# Altium project MCU_project.PrjPcb
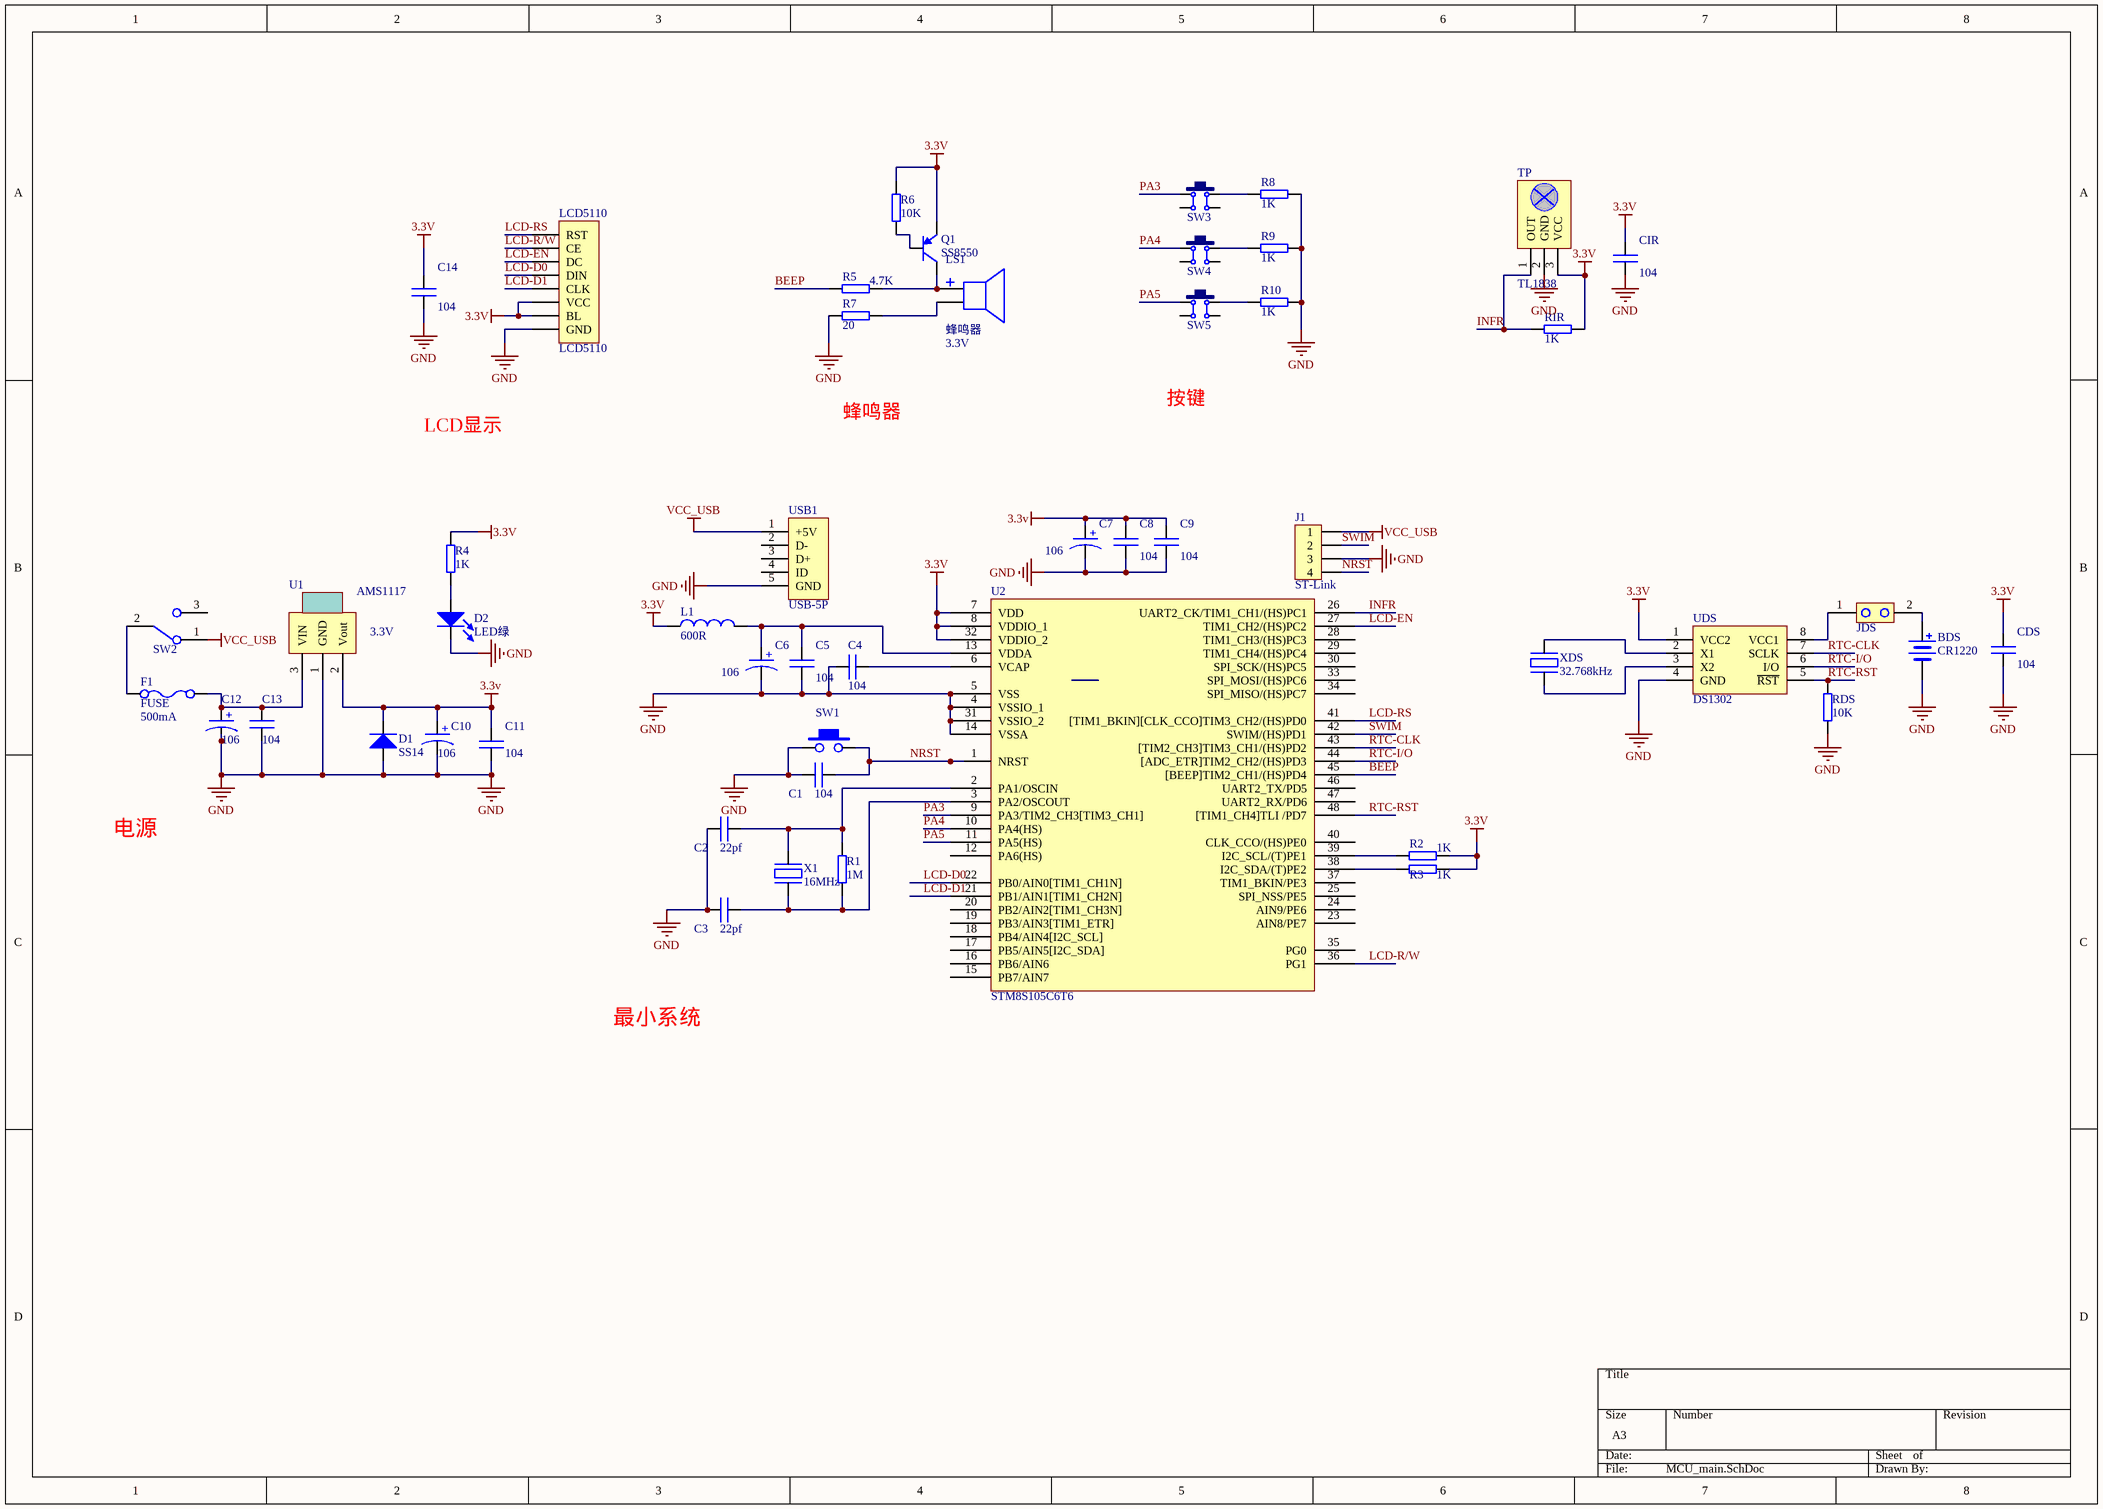
[diagram p0: MCU_main.SchDoc]
1 sheet, 50 parts. Net scope: global (net labels, ports and power ports of the same name join across sheets).
Board file: MCU_project.PcbDoc

## Sheet MCU_main.SchDoc
size A3; PageSetup: Record=PageOptions|CenterHorizontal=True|CenterVertical=True|PrintScale=1.00|XCorrection=1.00|YCorrection=1.00|PrintKind=1|BorderSize=5000000|LeftOffset=0|BottomOffset=0|Orientation=2|PaperLength=1000|PaperWidth=1000|Scale=100|PaperSource=7|PrintQuality=-3|MediaType=1|DitherType=10|PrintScaleMode=1|PaperKind=A3|PaperIndex=8

### Parts
BDS  CR1220  [CR1220-贴片]
C1  value 104  [0603]  (hidden comment: CAP - 无极性)
C2  value 22pf  [0603]  (hidden comment: CAP - 无极性)
C3  value 22pf  [0603]  (hidden comment: CAP - 无极性)
C4  value 104  [0603]  (hidden comment: CAP - 无极性)
C5  value 104  [0603]  (hidden comment: CAP - 无极性)
C6  value 106  [1206(-+)]  (hidden comment: CAP - 有极性)
C7  value 106  [1206(-+)]  (hidden comment: CAP - 有极性)
C8  value 104  [0603]  (hidden comment: CAP - 无极性)
C9  value 104  [0603]  (hidden comment: CAP - 无极性)
C10  value 106  [1206(-+)]  (hidden comment: CAP - 有极性)
C11  value 104  [0603]  (hidden comment: CAP - 无极性)
C12  value 106  [1206(-+)]  (hidden comment: CAP - 有极性)
C13  value 104  [0603]  (hidden comment: CAP - 无极性)
C14  value 104  [0603]  (hidden comment: CAP - 无极性)
CDS  value 104  [0603]  (hidden comment: CAP - 无极性)
CIR  value 104  [0603]  (hidden comment: CAP - 无极性)
D1  SS14  [SMA]
D2  LED绿  [0603(+-)]
F1  FUSE  value 500mA  [1812]
J1  ST-Link  [HEADER_1*4P_XH2.54_卧式]
JDS  HEADER_1*2P  [HEADER_1*2P]  (value not drawn)
L1  value 600R  [0603]  (hidden comment: L磁珠/电感)
LCD5110  LCD5110  [LCD5110]
LS1  蜂鸣器  value 3.3V  [蜂鸣器]
Q1  SS8550  [SOT23-3N]
R1  value 1M  [0603]  (hidden comment: Res - SMD)
R2  value 1K  [0603]  (hidden comment: Res - SMD)
R3  value 1K  [0603]  (hidden comment: Res - SMD)
R4  value 1K  [0603]  (hidden comment: Res - SMD)
R5  value 4.7K  [0603]  (hidden comment: Res - SMD)
R6  value 10K  [0603]  (hidden comment: Res - SMD)
R7  value 20  [0603]  (hidden comment: Res - SMD)
R8  value 1K  [0603]  (hidden comment: Res - SMD)
R9  value 1K  [0603]  (hidden comment: Res - SMD)
R10  value 1K  [0603]  (hidden comment: Res - SMD)
RDS  value 10K  [0603]  (hidden comment: Res - SMD)
RIR  value 1K  [0603]  (hidden comment: Res - SMD)
SW1  Switch - 轻触  [Switch - 轻触SMD_4Pins]  (value not drawn)
SW2  Switch - 拨动-三脚两档  [Switch - 拨动-三脚两档]  (value not drawn)
SW3  6x6x5  [TSW DIP-6*6*6]  (value not drawn)
SW4  6x6x5  [TSW DIP-6*6*6]  (value not drawn)
SW5  6x6x5  [TSW DIP-6*6*6]  (value not drawn)
TP  TL1838  [红外遥控接收头]
U1  AMS1117  value 3.3V  [SOT223_L]
U2  STM8S105C6T6  [LQFP48]
UDS  DS1302  [DIP-8]
USB1  USB-5P  [USB-MICRO_A]
X1  value 16MHz  [XTAL(4.88mm)]  (hidden comment: 石英晶振)
XDS  value 32.768kHz  [XTAL(圆柱型2*6mm)]  (hidden comment: 石英晶振)

### Nets
3.3V: C7.1(+) C8.1 C9.1 C10.1(+) C11.1 C14.1 CDS.1 CIR.1 D1.2 L1.1 LCD5110.6(VCC) LCD5110.7(BL) Q1.2(E) R2.2 R3.2 R4.1 R6.2 RIR.1 TP.3(VCC) U1.2(Vout) U2.7(VDD) U2.8(VDDIO_1) U2.32(VDDIO_2) UDS.1(VCC2)
GND: BDS.2(-) C1.1 C2.1 C3.1 C4.1 C5.2 C6.2 C7.2 C8.2 C9.2 C10.2 C11.2 C12.2 C13.1 C14.2 CDS.2 CIR.2 D1.1 D2.2(K) J1.3 LCD5110.8(GND) R7.1 R8.1 R9.2 R10.2 RDS.2 SW1.1 TP.2(GND) U1.1(GND) U2.4(VSSIO_1) U2.5(VSS) U2.14(VSSA) U2.31(VSSIO_2) UDS.4(GND) USB1.5(GND)
VCC_USB: J1.1 SW2.1 USB1.1(+5V)
BEEP: R5.1 U2.45([BEEP]TIM2_CH1/(HS)PD4)
INFR: RIR.2 TP.1(OUT) U2.26(UART2_CK/TIM1_CH1/(HS)PC1)
LCD-D0: LCD5110.4(DIN) U2.22(PB0/AIN0[TIM1_CH1N])
LCD-D1: LCD5110.5(CLK) U2.21(PB1/AIN1[TIM1_CH2N])
LCD-EN: LCD5110.3(DC) U2.27(TIM1_CH2/(HS)PC2)
LCD-R/W: LCD5110.2(CE) U2.36(PG1)
LCD-RS: LCD5110.1(RST) U2.41([TIM1_BKIN][CLK_CCO]TIM3_CH2/(HS)PD0)
NRST: C1.2 J1.4 SW1.2 U2.1(NRST)
PA3: SW3.1 U2.9(PA3/TIM2_CH3[TIM3_CH1])
PA4: SW4.1 U2.10(PA4(HS))
PA5: SW5.1 U2.11(PA5(HS))
RTC-CLK: U2.43([TIM2_CH3]TIM3_CH1/(HS)PD2) UDS.7(SCLK)
RTC-I/O: U2.44([ADC_ETR]TIM2_CH2/(HS)PD3) UDS.6(I/O)
RTC-RST: RDS.1 U2.48([TIM1_CH4]TLI_/PD7) UDS.5(~{RST})
SWIM: J1.2 U2.42(SWIM/(HS)PD1)
NetBDS_1: BDS.1(+) JDS.2
NetC2_2: C2.2 R1.2 U2.2(PA1/OSCIN) X1.2
NetC3_2: C3.2 R1.1 U2.3(PA2/OSCOUT) X1.1
NetC4_2: C4.2 U2.6(VCAP)
NetC5_1: C5.1 C6.1(+) L1.2 U2.13(VDDA)
NetC12_1: C12.1(+) C13.2 F1.2 U1.3(VIN)
NetD2_1: D2.1(A) R4.2
NetF1_1: F1.1 SW2.2
NetJDS_1: JDS.1 UDS.8(VCC1)
NetLS1_1: LS1.1 Q1.3(C) R5.2
NetLS1_2: LS1.2 R7.2
NetQ1_1: Q1.1(B) R6.1
NetR2_1: R2.1 U2.39(I2C_SCL/(T)PE1)
NetR3_1: R3.1 U2.38(I2C_SDA/(T)PE2)
NetR8_2: R8.2 SW3.2
NetR9_1: R9.1 SW4.2
NetR10_1: R10.1 SW5.2
NetUDS_2: UDS.2(X1) XDS.1
NetUDS_3: UDS.3(X2) XDS.2

Not connected (* = marked no-connect by the designer): SW2 3; SW3 3 4; SW4 3 4; SW5 3 4; U2 12(PA6(HS)) 15(PB7/AIN7) 16(PB6/AIN6) 17(PB5/AIN5[I2C_SDA]) 18(PB4/AIN4[I2C_SCL]) 19(PB3/AIN3[TIM1_ETR]) 20(PB2/AIN2[TIM1_CH3N]) 23(AIN8/PE7) 24(AIN9/PE6) 25(SPI_NSS/PE5) 28(TIM1_CH3/(HS)PC3) 29(TIM1_CH4/(HS)PC4) 30(SPI_SCK/(HS)PC5) 33(SPI_MOSI/(HS)PC6) 34(SPI_MISO/(HS)PC7) 35(PG0) 37(TIM1_BKIN/PE3) 40(CLK_CCO/(HS)PE0) 46(UART2_TX/PD5) 47(UART2_RX/PD6); USB1 2(D-) 3(D+) 4(ID)

### Notes on the sheet
- LCD显示
- 蜂鸣器
- 按键
- 电源
- 最小系统

### Library data of the parts
BDS = Battery
D1 = Diode - Normal
D2 = LED
F1 = FUSE保险丝
J1 = HEADER_1*4P_1: Value: 4P-XH2.54插座
Q1 = 8550-SMD: 高频放大-PNP型; 版权归属: 源创客; 属性: 40V 1.5A 1W 100MHZ; BOM名称: 高频放大-PNP型; 学习资源: www.ooocke.com
SW3-SW5 = TSW DIP-6x6: 直插6x6轻触开关; 版权归属: 源创客; BOM名称: 直插6x6轻触开关; 学习资源: www.ooocke.com
TP = TL1838-红外解码
USB1 = USB-5P: 微型USB母座; 版权归属: 源创客; BOM名称: 微型USB母座; 学习资源: www.ooocke.com
XDS = 石英晶振_1